# Altium schematic sheet Motor2_PCIe.SchDoc
size B
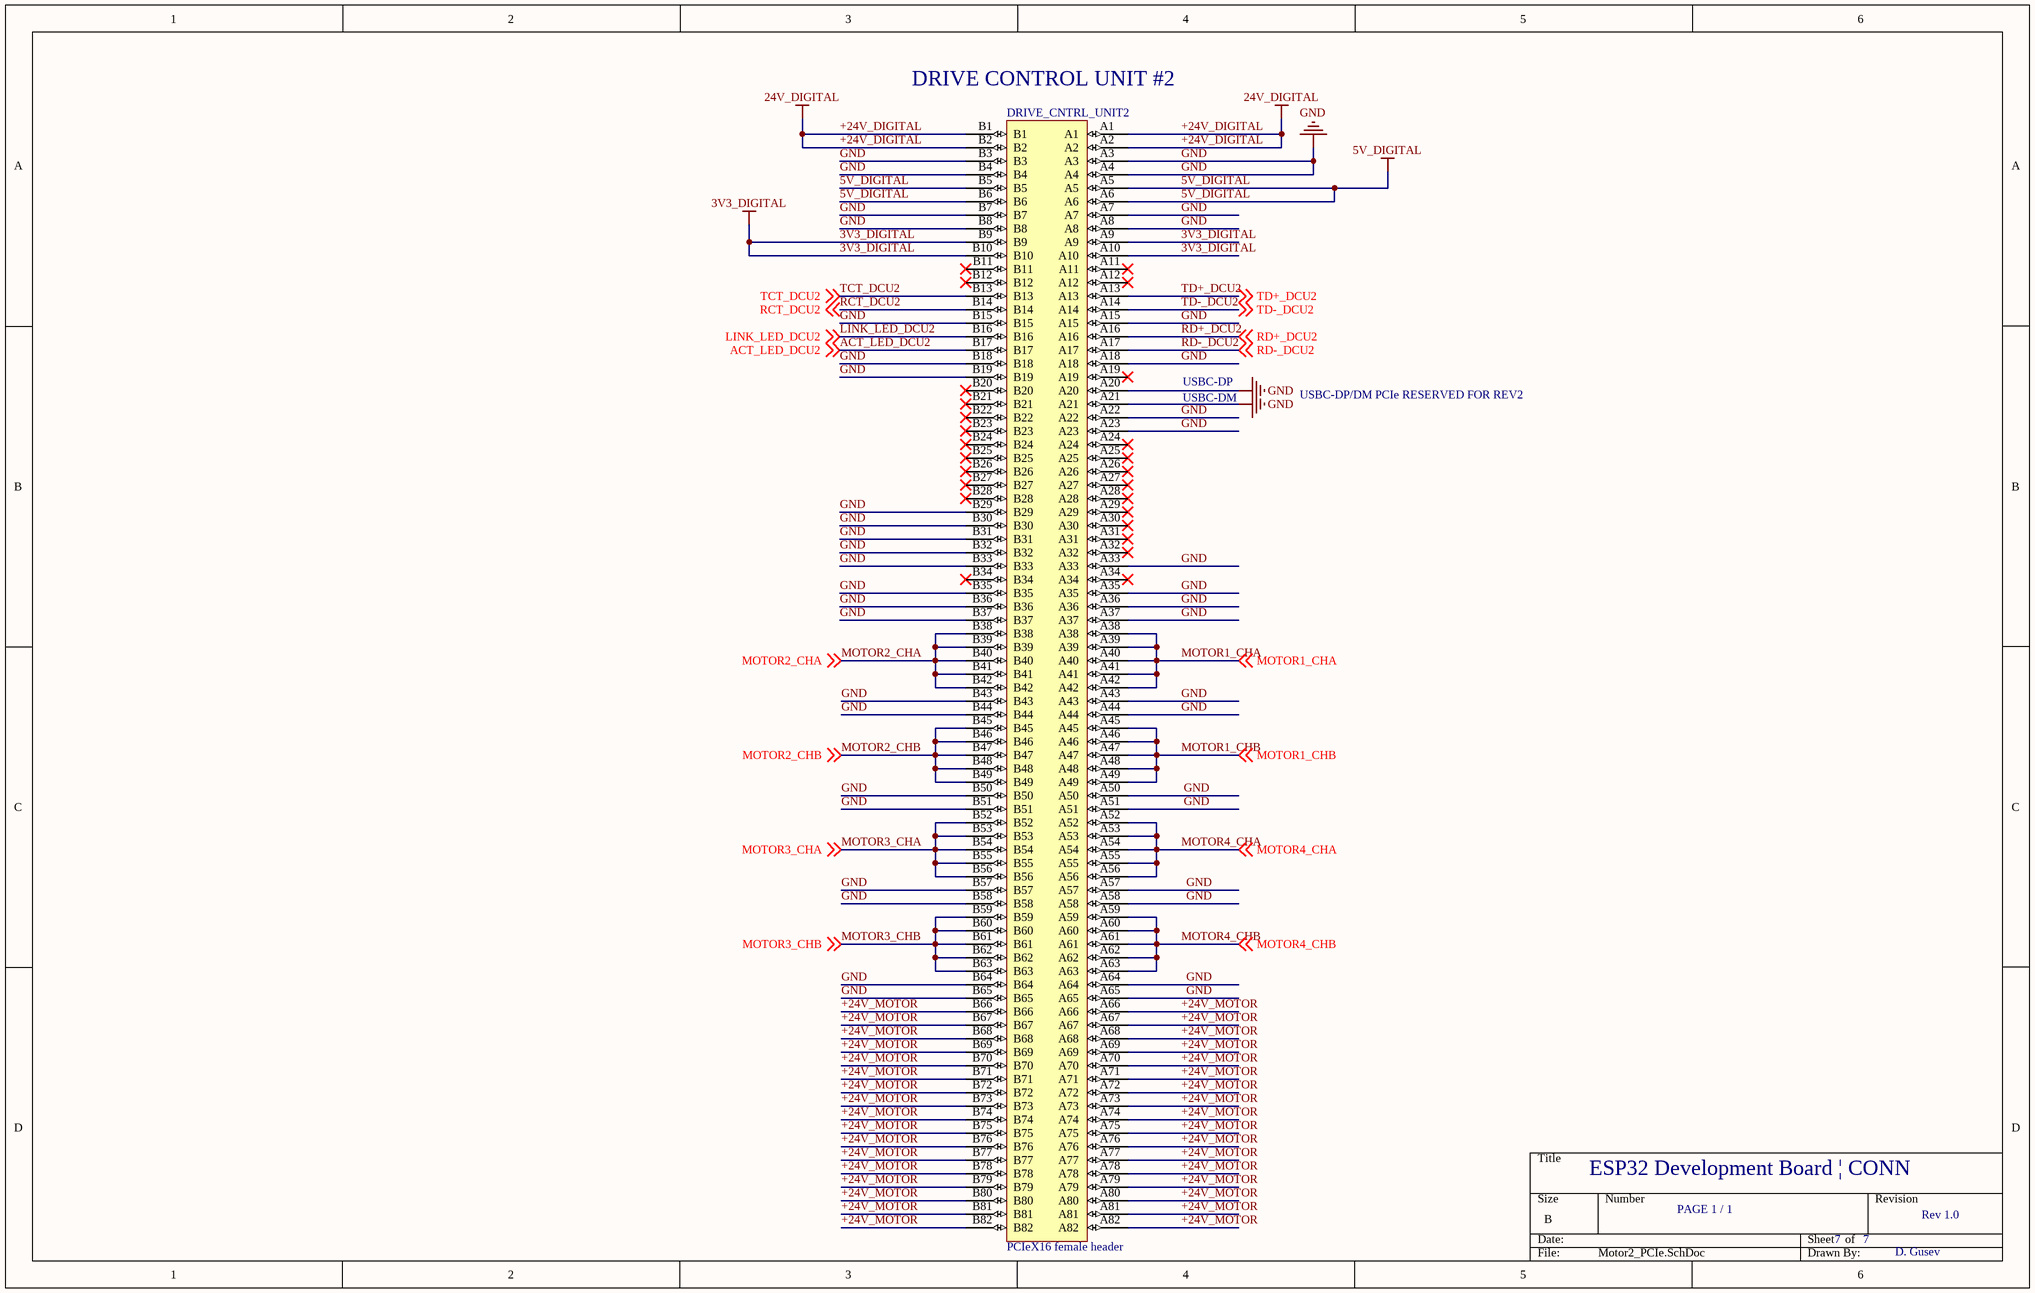
[diagram p0: Motor2_PCIe.SchDoc]

## Parts
DRIVE_CNTRL_UNIT2  PCIeX16 female header  [SAMTEC_PCIE-164-02-X-D-TH]

## Nets
3V3_DIGITAL: DRIVE_CNTRL_UNIT2.A9 DRIVE_CNTRL_UNIT2.A10 DRIVE_CNTRL_UNIT2.B9 DRIVE_CNTRL_UNIT2.B10
5V_DIGITAL: DRIVE_CNTRL_UNIT2.A5 DRIVE_CNTRL_UNIT2.A6 DRIVE_CNTRL_UNIT2.B5 DRIVE_CNTRL_UNIT2.B6
+24V_DIGITAL: DRIVE_CNTRL_UNIT2.A1 DRIVE_CNTRL_UNIT2.A2 DRIVE_CNTRL_UNIT2.B1 DRIVE_CNTRL_UNIT2.B2  [also labelled 24V_DIGITAL]
GND: DRIVE_CNTRL_UNIT2.A3 DRIVE_CNTRL_UNIT2.A4 DRIVE_CNTRL_UNIT2.A7 DRIVE_CNTRL_UNIT2.A8 DRIVE_CNTRL_UNIT2.A15 DRIVE_CNTRL_UNIT2.A18 DRIVE_CNTRL_UNIT2.A20 DRIVE_CNTRL_UNIT2.A21 DRIVE_CNTRL_UNIT2.A22 DRIVE_CNTRL_UNIT2.A23 DRIVE_CNTRL_UNIT2.A33 DRIVE_CNTRL_UNIT2.A35 DRIVE_CNTRL_UNIT2.A36 DRIVE_CNTRL_UNIT2.A37 DRIVE_CNTRL_UNIT2.A43 DRIVE_CNTRL_UNIT2.A44 DRIVE_CNTRL_UNIT2.A50 DRIVE_CNTRL_UNIT2.A51 DRIVE_CNTRL_UNIT2.A57 DRIVE_CNTRL_UNIT2.A58 DRIVE_CNTRL_UNIT2.A64 DRIVE_CNTRL_UNIT2.A65 DRIVE_CNTRL_UNIT2.B3 DRIVE_CNTRL_UNIT2.B4 DRIVE_CNTRL_UNIT2.B7 DRIVE_CNTRL_UNIT2.B8 DRIVE_CNTRL_UNIT2.B15 DRIVE_CNTRL_UNIT2.B18 DRIVE_CNTRL_UNIT2.B19 DRIVE_CNTRL_UNIT2.B29 DRIVE_CNTRL_UNIT2.B30 DRIVE_CNTRL_UNIT2.B31 DRIVE_CNTRL_UNIT2.B32 DRIVE_CNTRL_UNIT2.B33 DRIVE_CNTRL_UNIT2.B35 DRIVE_CNTRL_UNIT2.B36 DRIVE_CNTRL_UNIT2.B37 DRIVE_CNTRL_UNIT2.B43 DRIVE_CNTRL_UNIT2.B44 DRIVE_CNTRL_UNIT2.B50 DRIVE_CNTRL_UNIT2.B51 DRIVE_CNTRL_UNIT2.B57 DRIVE_CNTRL_UNIT2.B58 DRIVE_CNTRL_UNIT2.B64 DRIVE_CNTRL_UNIT2.B65
+24V_MOTOR: DRIVE_CNTRL_UNIT2.A66 DRIVE_CNTRL_UNIT2.A67 DRIVE_CNTRL_UNIT2.A68 DRIVE_CNTRL_UNIT2.A69 DRIVE_CNTRL_UNIT2.A70 DRIVE_CNTRL_UNIT2.A71 DRIVE_CNTRL_UNIT2.A72 DRIVE_CNTRL_UNIT2.A73 DRIVE_CNTRL_UNIT2.A74 DRIVE_CNTRL_UNIT2.A75 DRIVE_CNTRL_UNIT2.A76 DRIVE_CNTRL_UNIT2.A77 DRIVE_CNTRL_UNIT2.A78 DRIVE_CNTRL_UNIT2.A79 DRIVE_CNTRL_UNIT2.A80 DRIVE_CNTRL_UNIT2.A81 DRIVE_CNTRL_UNIT2.A82 DRIVE_CNTRL_UNIT2.B66 DRIVE_CNTRL_UNIT2.B67 DRIVE_CNTRL_UNIT2.B68 DRIVE_CNTRL_UNIT2.B69 DRIVE_CNTRL_UNIT2.B70 DRIVE_CNTRL_UNIT2.B71 DRIVE_CNTRL_UNIT2.B72 DRIVE_CNTRL_UNIT2.B73 DRIVE_CNTRL_UNIT2.B74 DRIVE_CNTRL_UNIT2.B75 DRIVE_CNTRL_UNIT2.B76 DRIVE_CNTRL_UNIT2.B77 DRIVE_CNTRL_UNIT2.B78 DRIVE_CNTRL_UNIT2.B79 DRIVE_CNTRL_UNIT2.B80 DRIVE_CNTRL_UNIT2.B81 DRIVE_CNTRL_UNIT2.B82
ACT_LED_DCU2: DRIVE_CNTRL_UNIT2.B17 ; off-sheet ACT_LED_DCU2
LINK_LED_DCU2: DRIVE_CNTRL_UNIT2.B16 ; off-sheet LINK_LED_DCU2
MOTOR1_CHA: DRIVE_CNTRL_UNIT2.A38 DRIVE_CNTRL_UNIT2.A39 DRIVE_CNTRL_UNIT2.A40 DRIVE_CNTRL_UNIT2.A41 DRIVE_CNTRL_UNIT2.A42 ; off-sheet MOTOR1_CHA
MOTOR1_CHB: DRIVE_CNTRL_UNIT2.A45 DRIVE_CNTRL_UNIT2.A46 DRIVE_CNTRL_UNIT2.A47 DRIVE_CNTRL_UNIT2.A48 DRIVE_CNTRL_UNIT2.A49 ; off-sheet MOTOR1_CHB
MOTOR2_CHA: DRIVE_CNTRL_UNIT2.B38 DRIVE_CNTRL_UNIT2.B39 DRIVE_CNTRL_UNIT2.B40 DRIVE_CNTRL_UNIT2.B41 DRIVE_CNTRL_UNIT2.B42 ; off-sheet MOTOR2_CHA
MOTOR2_CHB: DRIVE_CNTRL_UNIT2.B45 DRIVE_CNTRL_UNIT2.B46 DRIVE_CNTRL_UNIT2.B47 DRIVE_CNTRL_UNIT2.B48 DRIVE_CNTRL_UNIT2.B49 ; off-sheet MOTOR2_CHB
MOTOR3_CHA: DRIVE_CNTRL_UNIT2.B52 DRIVE_CNTRL_UNIT2.B53 DRIVE_CNTRL_UNIT2.B54 DRIVE_CNTRL_UNIT2.B55 DRIVE_CNTRL_UNIT2.B56 ; off-sheet MOTOR3_CHA
MOTOR3_CHB: DRIVE_CNTRL_UNIT2.B59 DRIVE_CNTRL_UNIT2.B60 DRIVE_CNTRL_UNIT2.B61 DRIVE_CNTRL_UNIT2.B62 DRIVE_CNTRL_UNIT2.B63 ; off-sheet MOTOR3_CHB
MOTOR4_CHA: DRIVE_CNTRL_UNIT2.A52 DRIVE_CNTRL_UNIT2.A53 DRIVE_CNTRL_UNIT2.A54 DRIVE_CNTRL_UNIT2.A55 DRIVE_CNTRL_UNIT2.A56 ; off-sheet MOTOR4_CHA
MOTOR4_CHB: DRIVE_CNTRL_UNIT2.A59 DRIVE_CNTRL_UNIT2.A60 DRIVE_CNTRL_UNIT2.A61 DRIVE_CNTRL_UNIT2.A62 DRIVE_CNTRL_UNIT2.A63 ; off-sheet MOTOR4_CHB
RCT_DCU2: DRIVE_CNTRL_UNIT2.B14 ; off-sheet RCT_DCU2
RD+_DCU2: DRIVE_CNTRL_UNIT2.A16 ; off-sheet RD+_DCU2
RD-_DCU2: DRIVE_CNTRL_UNIT2.A17 ; off-sheet RD-_DCU2
TCT_DCU2: DRIVE_CNTRL_UNIT2.B13 ; off-sheet TCT_DCU2
TD+_DCU2: DRIVE_CNTRL_UNIT2.A13 ; off-sheet TD+_DCU2
TD-_DCU2: DRIVE_CNTRL_UNIT2.A14 ; off-sheet TD-_DCU2

Not connected (* = marked no-connect by the designer): DRIVE_CNTRL_UNIT2 A11* A12* A19* A24* A25* A26* A27* A28* A29* A30* A31* A32* A34* B11* B12* B20* B21* B22* B23* B24* B25* B26* B27* B28* B34*

## Notes on the sheet
- (near DRIVE_CNTRL_UNIT2) DRIVE CONTROL UNIT #2
- USBC-DP
- USBC-DM
- USBC-DP/DM PCIe RESERVED FOR REV2
- ESP32 Development Board | CONN
- PAGE 1 / 1
- 7
- Rev 1.0
- D. Gusev

## Library data of the parts
DRIVE_CNTRL_UNIT2 = PCIeX16 female header: 164-position SAMTEC female header